# Altium schematic sheet Sheet3.SchDoc
size A3; PageSetup: Record=PageOptions|CenterHorizontal=True|CenterVertical=True|PrintScale=1.00|XCorrection=1.00|YCorrection=1.00|PrintKind=1|BorderSize=5000000|LeftOffset=0|BottomOffset=0|Orientation=2|PaperLength=1000|PaperWidth=1000|Scale=100|PaperSource=7|PrintQuality=-3|MediaType=1|DitherType=10|PrintScaleMode=1|PaperKind=A3|PaperIndex=8
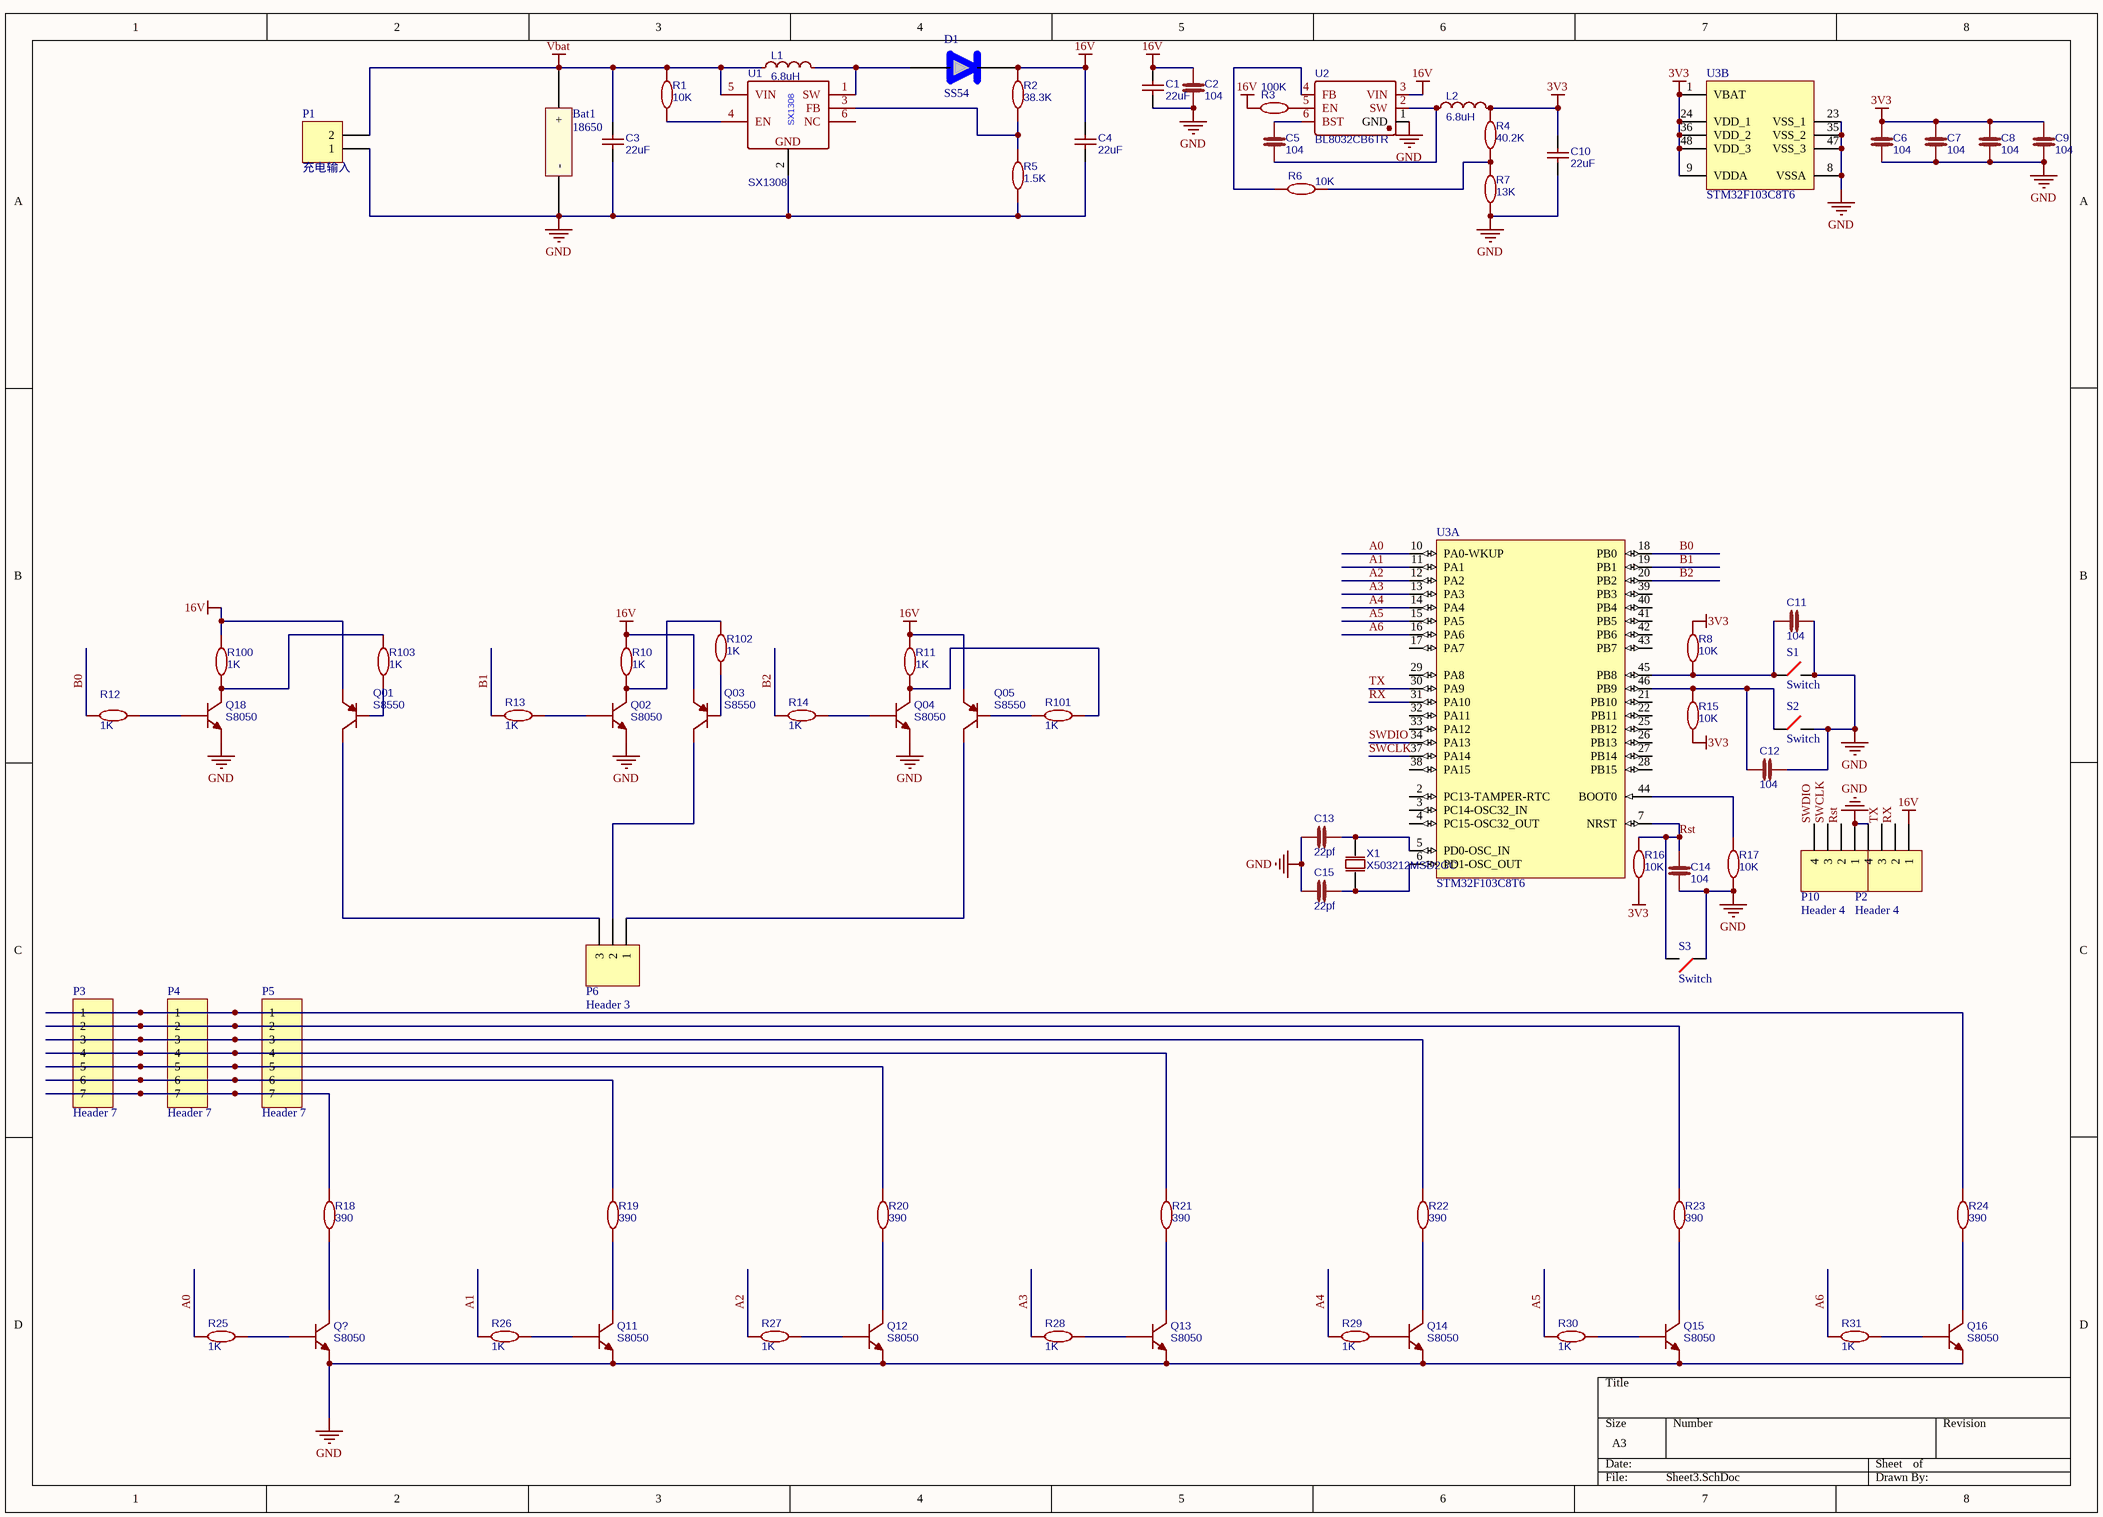
[diagram p0: Sheet3.SchDoc]

## Parts
Bat1  18650  [18650]
C1  22uF  [0805]
C2  104  [0402-CAP]
C3  22uF  [0805]
C4  22uF  [0805]
C5  104  [0402-CAP]
C6  104  [0402-CAP]
C7  104  [0402-CAP]
C8  104  [0402-CAP]
C9  104  [0402-CAP]
C10  22uF  [0805]
C11  104  [0402-CAP]
C12  104  [0402-CAP]
C13  22pf  [0402-CAP]
C14  104  [0402-CAP]
C15  22pf  [0402-CAP]
D1  SS54  [DIOM4225X24N]
L1  6.8uH  [L-SMD-6.0X6.0X4.7]
L2  6.8uH  [L-SMD-6.0X6.0X4.7]
P1  充电输入  [HDR1X2]
P2  Header 4  [HDR1X4]
P3  Header 7  [HDR1X7]
P4  Header 7  [HDR1X7]
P5  Header 7  [HDR1X7]
P6  Header 3  [HDR1X3]
P10  Header 4  [HDR1X4]
Q01  S8550  [SOT-23(SOT-23-3)]
Q02  S8050  [SOT-23(SOT-23-3)]
Q03  S8550  [SOT-23(SOT-23-3)]
Q04  S8050  [SOT-23(SOT-23-3)]
Q05  S8550  [SOT-23(SOT-23-3)]
Q11  S8050  [SOT-23(SOT-23-3)]
Q12  S8050  [SOT-23(SOT-23-3)]
Q13  S8050  [SOT-23(SOT-23-3)]
Q14  S8050  [SOT-23(SOT-23-3)]
Q15  S8050  [SOT-23(SOT-23-3)]
Q16  S8050  [SOT-23(SOT-23-3)]
Q18  S8050  [SOT-23(SOT-23-3)]
Q?  S8050  [SOT-23(SOT-23-3)]
R1  10K  [0402]
R2  38.3K  [0402]
R3  100K  [0402]
R4  40.2K  [0402]
R5  1.5K  [0402]
R6  10K  [0402]
R7  13K  [0402]
R8  10K  [0402]
R10  1K  [0402]
R11  1K  [0402]
R12  1K  [0402]
R13  1K  [0402]
R14  1K  [0402]
R15  10K  [0402]
R16  10K  [0402]
R17  10K  [0402]
R18  390  [0402]
R19  390  [0402]
R20  390  [0402]
R21  390  [0402]
R22  390  [0402]
R23  390  [0402]
R24  390  [0402]
R25  1K  [0402]
R26  1K  [0402]
R27  1K  [0402]
R28  1K  [0402]
R29  1K  [0402]
R30  1K  [0402]
R31  1K  [0402]
R100  1K  [0402]
R101  1K  [0402]
R102  1K  [0402]
R103  1K  [0402]
S1  Switch  [Switch_Liu]
S2  Switch  [Switch_Liu]
S3  Switch  [Switch_Liu]
U1  SX1308  [SOT-23-6]
U2  BL8032CB6TR  [SOT-23-6]
U3  STM32F103C8T6  [STM-LQFP48_N]  (parts A,B of 2)
X1  X503212MSD2GC  [OSC-YSX-5032_2P]

## Nets
3V3: C6.2 C7.2 C8.2 C9.2 C10.2 L2.2 R4.1 R8.2 R15.1 R16.2 U3.1(VBAT) U3.9(VDDA) U3.24(VDD_1) U3.36(VDD_2) U3.48(VDD_3)
16V: C1.2 C2.2 C4.2 D1.2 P2.1 Q01.2 Q03.2 Q05.2 R2.2 R3.2 R10.2 R11.2 R100.2 U2.3(VIN)
GND: Bat1.2(-) C1.1 C2.1 C3.1 C4.1 C6.1 C7.1 C8.1 C9.1 C10.1 C11.1 C12.1 C13.1 C14.1 C15.1 P1.1 P2.4 P10.1 Q02.2(E) Q04.2(E) Q11.2(E) Q12.2(E) Q13.2(E) Q14.2(E) Q15.2(E) Q16.2(E) Q18.2(E) Q?.2(E) R5.1 R7.2 R17.1 S1.2 S2.2 S3.1 U1.2(GND) U2.1(GND) U3.8(VSSA) U3.23(VSS_1) U3.35(VSS_2) U3.47(VSS_3)
Vbat: Bat1.1(+) C3.2 L1.1 P1.2 R1.2 U1.5(VIN)
A0: R25.1 U3.10(PA0-WKUP)
A1: R26.1 U3.11(PA1)
A2: R27.1 U3.12(PA2)
A3: R28.1 U3.13(PA3)
A4: R29.1 U3.14(PA4)
A5: R30.1 U3.15(PA5)
A6: R31.1 U3.16(PA6)
B0: R12.1 U3.18(PB0)
B1: R13.1 U3.19(PB1)
B2: R14.1 U3.20(PB2)
Rst: C14.2 P10.2 R16.1 S3.2 U3.7(NRST)
RX: P2.2 U3.31(PA10)
SWCLK: P10.3 U3.37(PA14)
SWDIO: P10.4 U3.34(PA13)
TX: P2.3 U3.30(PA9)
NetC5_1: C5.1 L2.1 U2.2(SW)
NetC5_2: C5.2 U2.6(BST)
NetC11_2: C11.2 R8.1 S1.1 U3.45(PB8)
NetC12_2: C12.2 R15.2 S2.1 U3.46(PB9)
NetC13_2: C13.2 U3.5(PD0-OSC_IN) X1.1(OSC1)
NetC15_2: C15.2 U3.6(PD1-OSC_OUT) X1.2(OSC2)
NetD1_1: D1.1 L1.2 U1.1(SW)
NetP3_1: P3.1 P4.1 P5.1 R24.2
NetP3_2: P3.2 P4.2 P5.2 R23.2
NetP3_3: P3.3 P4.3 P5.3 R22.2
NetP3_4: P3.4 P4.4 P5.4 R21.2
NetP3_5: P3.5 P4.5 P5.5 R20.2
NetP3_6: P3.6 P4.6 P5.6 R19.2
NetP3_7: P3.7 P4.7 P5.7 R18.2
NetP6_1: P6.1 Q05.3
NetP6_2: P6.2 Q03.3
NetP6_3: P6.3 Q01.3
NetQ01_1: Q01.1 R103.1
NetQ02_1: Q02.1(B) R13.2
NetQ02_3: Q02.3(C) R10.1 R102.2
NetQ03_1: Q03.1 R102.1
NetQ04_1: Q04.1(B) R14.2
NetQ04_3: Q04.3(C) R11.1 R101.1
NetQ05_1: Q05.1 R101.2
NetQ11_1: Q11.1(B) R26.2
NetQ11_3: Q11.3(C) R19.1
NetQ12_1: Q12.1(B) R27.2
NetQ12_3: Q12.3(C) R20.1
NetQ13_1: Q13.1(B) R28.2
NetQ13_3: Q13.3(C) R21.1
NetQ14_1: Q14.1(B) R29.2
NetQ14_3: Q14.3(C) R22.1
NetQ15_1: Q15.1(B) R30.2
NetQ15_3: Q15.3(C) R23.1
NetQ16_1: Q16.1(B) R31.2
NetQ16_3: Q16.3(C) R24.1
NetQ18_1: Q18.1(B) R12.2
NetQ18_3: Q18.3(C) R100.1 R103.2
NetQ?_1: Q?.1(B) R25.2
NetQ?_3: Q?.3(C) R18.1
NetR1_1: R1.1 U1.4(EN)
NetR2_1: R2.1 R5.2 U1.3(FB)
NetR3_1: R3.1 U2.5(EN)
NetR4_2: R4.2 R6.1 R7.1
NetR6_2: R6.2 U2.4(FB)
NetR17_2: R17.2 U3.44(BOOT0)

Not connected (* = marked no-connect by the designer): U1 6(NC); U3 2(PC13-TAMPER-RTC) 3(PC14-OSC32_IN) 4(PC15-OSC32_OUT) 17(PA7) 21(PB10) 22(PB11) 25(PB12) 26(PB13) 27(PB14) 28(PB15) 29(PA8) 32(PA11) 33(PA12) 38(PA15) 39(PB3) 40(PB4) 41(PB5) 42(PB6) 43(PB7)

## Library data of the parts
C1 C3 C4 C10 = 1uF: BOM_Manufacturer: TAIYO YUDEN; BOM_Manufacturer Part: TMK212BJ105KG-T; nameAlias: Capacitance; BOM_Supplier: LCSC; BOM_Supplier Part: C92829; spicePre: C; spiceSymbolName: TMK212BJ105KG-T
C2 C5-C9 C11-C15 = 0.1UF-16V(+-10%)(0402): Contributor: SparkFun; BOM_Manufacturer Part: ?; spicePre: C
L1 L2 = 6.8uH: BOM_Manufacturer: CENKER; BOM_Manufacturer Part: CKCS6045-6.8uH/M; nameAlias: Value; Contributor: LCSC; BOM_Supplier: LCSC; BOM_Supplier Part: C354631; spicePre: L; spiceSymbolName: CKCS6045-6.8UH/M
P1 = Header 2: Header, 2-Pin; LatestRevisionDate: 17-Jul-2002; LatestRevisionNote: Re-released for DXP Platform.; Publisher: Altium Limited
P2 P10 = Header 4: Header, 4-Pin; LatestRevisionDate: 17-Jul-2002; LatestRevisionNote: Re-released for DXP Platform.; Publisher: Altium Limited
P3-P5 = Header 7: Header, 7-Pin; LatestRevisionDate: 17-Jul-2002; LatestRevisionNote: Re-released for DXP Platform.; Publisher: Altium Limited
P6 = Header 3: Header, 3-Pin; LatestRevisionDate: 17-Jul-2002; LatestRevisionNote: Re-released for DXP Platform.; Publisher: Altium Limited
Q01 Q03 Q05 = S8550: BOM_Manufacturer: CJ; SMT Type: Extend; BOM_Supplier: LCSC; BOM_Manufacturer Part: S8550; BOM_Supplier Part: C105432; BOM_LCSC Assembly: Yes; spicePre: Q
Q02 Q04 Q11-Q16 Q18 Q? = S8050: BOM_Manufacturer: Yenji; Contributor: LCSC; SMT Type: Extend; BOM_Supplier: LCSC; BOM_Manufacturer Part: S8050; BOM_Supplier Part: C139514; BOM_LCSC Assembly: Yes; spicePre: Q
R1-R8 R10-R31 R100-R103 = 1K: BOM_Manufacturer: KAMAYA; BOM_Manufacturer Part: RMC1/16S-102JTH-M; nameAlias: Resistance (Ohms); Contributor: LCSC; BOM_Supplier: LCSC; BOM_Supplier Part: C340521; spicePre: R; spiceSymbolName: RMC1/16S-102JTH-M
U1 = SX1308: BOM_Manufacturer: SX; sourceId: g4Yg9rJ1j; SMT Type: Extend; timeStamp: 1472247539; BOM_Supplier: LCSC; BOM_Manufacturer Part: SX1308; image: //image.lceda.cn/szlcsc/C78162.jpg; BOM_Supplier Part: C78162; BOM_LCSC Assembly: Yes; spicePre: U
U2 = BL8032CB6TR: BOM_Manufacturer: BL; Contributor: LCSC; BOM_Supplier: LCSC; BOM_Manufacturer Part: BL8032CB6TR; BOM_Supplier Part: C93180; spicePre: U
U3 = STM32F103C8T6: ARM Cortex-M3 32-bit MCU, 64 KB Flash, 20 KB Internal RAM, 37 I/Os, 48-pin LQFP, -40 to 85 degC, Tray; A/D Converter: 2x12-bit (10 Channel); FLASH Size (Prog) (kB): 64; I/Os (High Current): 37; Internal RAM Size (kB): 20; Operating Frequency(F) (Processor speed) (MHz): 72; Supply Voltage(Vcc) min (V): 2; DatasheetVersion: Rev. 16; PackageVersion: Rev. 6, 06/2013; PackageReference: LQFP48; PackageDescription: 48-Pin Low Profile Quad Flat Package, 7 x 7 mm Body, 0.5 mm Pitch; Supplier 1: Digi-Key; Supplier Part Number 1: 497-6063-ND; Supplier 2: Farnell; Supplier Part Number 2: 1447637; Supplier 3: Newark; Supplier Part Number 3: 59M2182; Supplier 4: Newark; Supplier Part Number 4: 57P1222; Supplier 5: Mouser; Supplier Part Number 5: 511-STM32F103C8T6; Core: ARM Cortex-M3; Packing: Tray; Mounting Technology: Surface Mount; PartNumber: STM32F103C8T6; ComponentLink1Description: Manufacturer URL; ComponentLink1URL: http://www.st.com/web/en/home.html; ComponentLink2Description: Datasheet; ComponentLink2URL: http://www.st.com/st-web-ui/static/active/en/resource/technical/document/datasheet/CD00161566.pdf; ComponentLink3Description: Package Specification; ComponentLink3URL: http://www.st.com/st-web-ui/static/active/en/resource/technical/document/datasheet/DM00058181.pdf
X1 = X503212MSD2GC: BOM_Manufacturer: YXC; Value: 12MHZ; BOM_Supplier Part: C33728; BOM_Supplier: LCSC; BOM_Manufacturer Part: X503212MSD2GC; image: http://image.lceda.cn/szlcsc/C33728.jpg; spicePre: X